# EAGLE board pressure_rigid_v2_no_flex (EAGLE 9.3.1), part 1 of 2
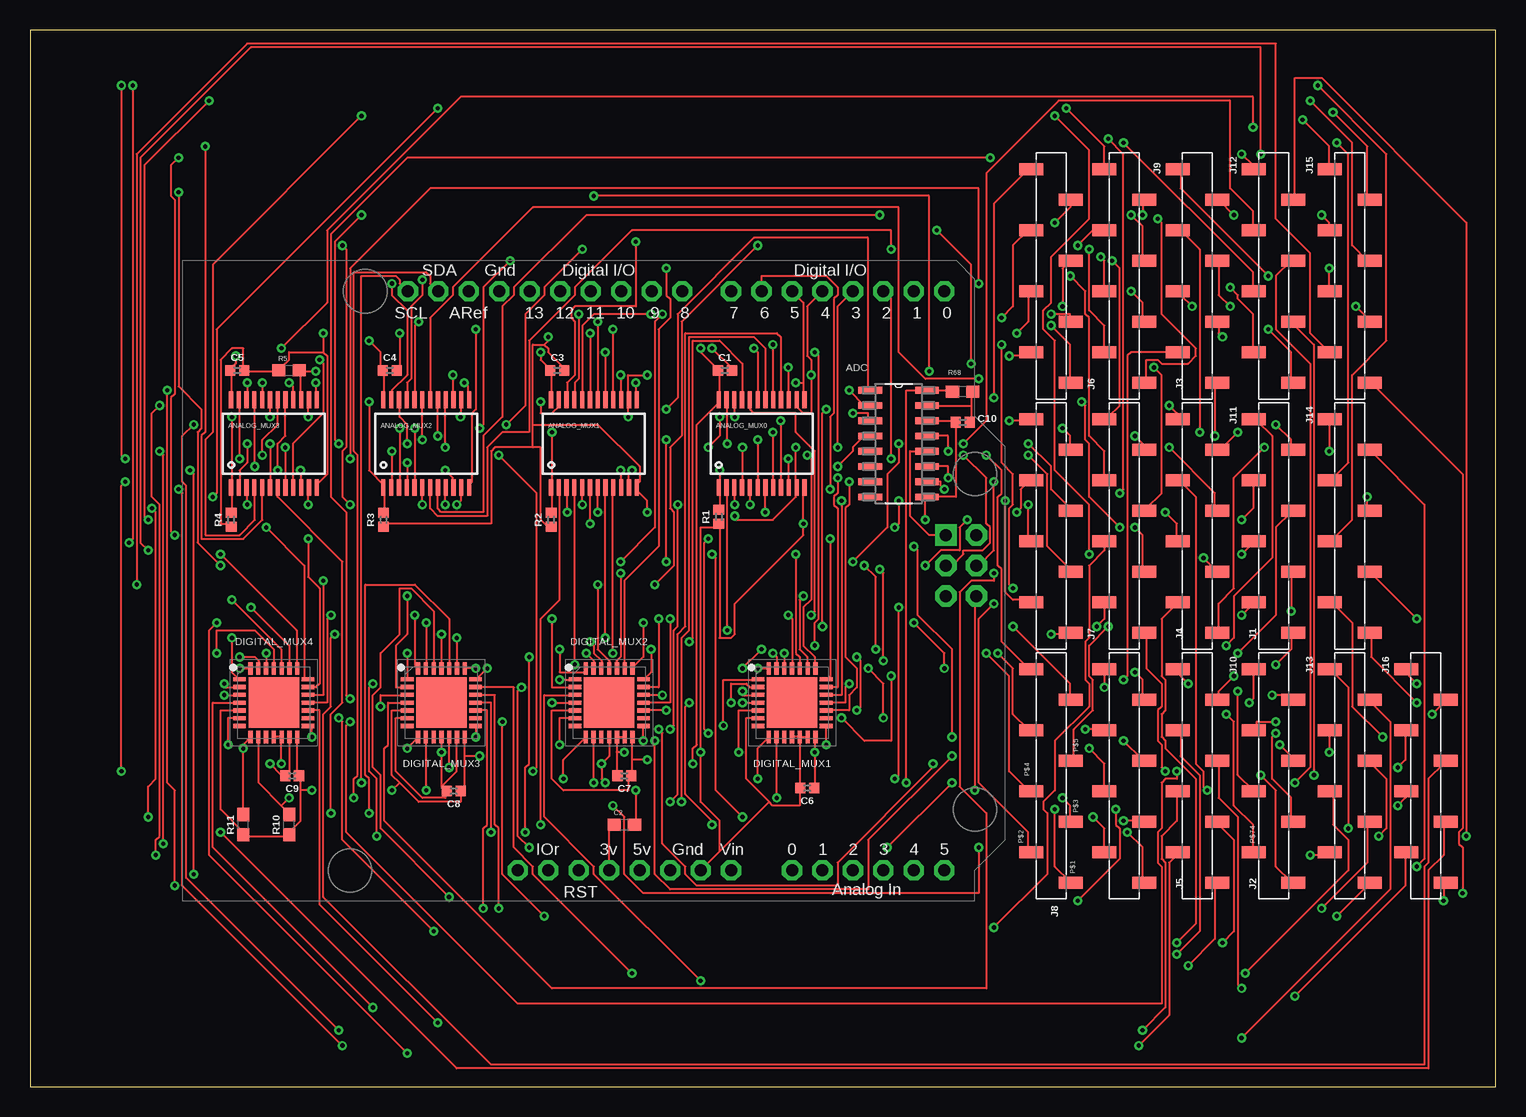
[diagram p1: board, top side]
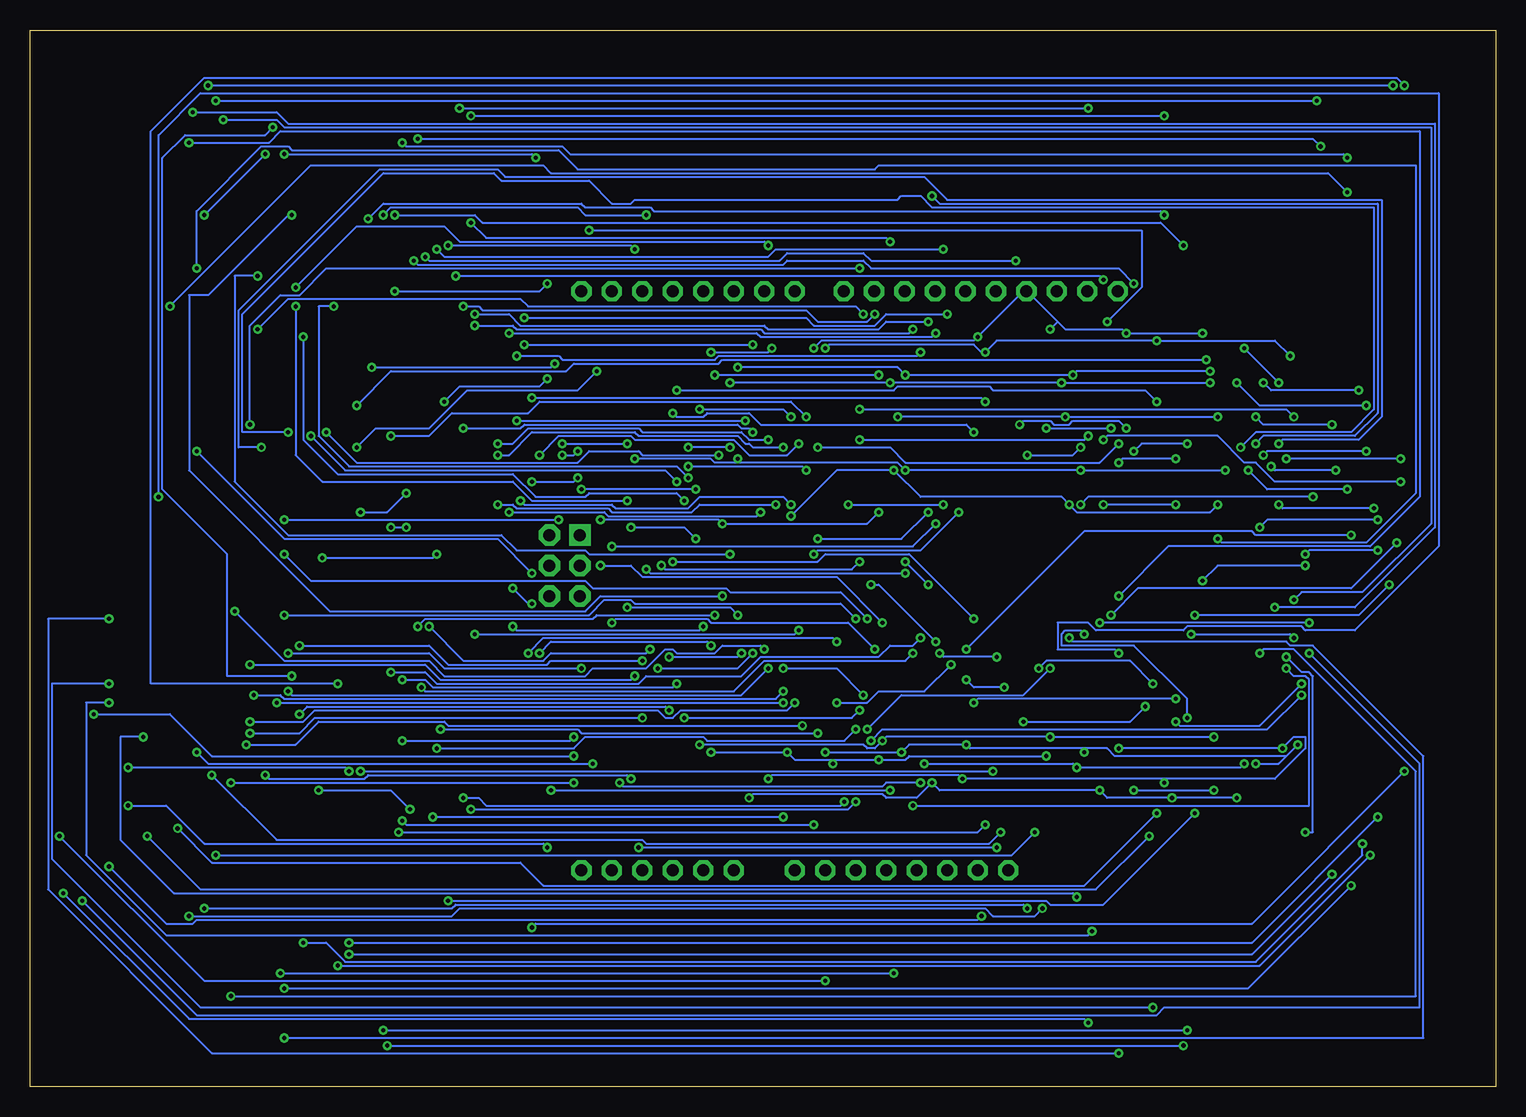
[diagram p2: board, bottom side, seen from below]

Size 122.15 x 88.06 mm. Coordinates in mm from the lower left corner, seen from the top.
Outline: 0,0 122.15,0 122.15,88.06 0,88.06 0,0
Copper layers (1*16): Top 0.035mm / dielectric 1.5mm / Bottom 0.035mm
Design rules "default": minimum track width 6mil, minimum drill 0.35mm, track to track 6mil, track to pad 6mil, pad to pad 6mil, via to via 6mil, smd to smd 6mil, copper to edge 40mil, drill to drill 6mil, minimum pad ring 10mil, minimum via ring 8mil, stop-mask expansion 4mil, vias tented up to drill 0mil, thermal gap 10mil
Net classes: 1 supply: width 0.076 mm, drill 0.076 mm, clearance 0.076 mm

## Footprints (pad centres in the part's own frame; a part is rotated, then mirrored left to right if it is on the bottom)
SOIC127P600X175-16N = smd 1.981 x 0.559: 1 -2.362,4.445; 2 -2.362,3.175; 3 -2.362,1.905; 4 -2.362,0.635; 5 -2.362,-0.635; 6 -2.362,-1.905; 7 -2.362,-3.175; 8 -2.362,-4.445; 9 2.362,-4.445; 10 2.362,-3.175; 11 2.362,-1.905; 12 2.362,-0.635; 13 2.362,0.635; 14 2.362,1.905; 15 2.362,3.175; 16 2.362,4.445
SSOP24 = smd 0.348 x 1.397: 1 -3.575,-3.656; 2 -2.925,-3.656; 3 -2.275,-3.656; 4 -1.625,-3.656; 5 -0.975,-3.656; 6 -0.325,-3.656; 7 0.325,-3.656; 8 0.975,-3.656; 9 1.625,-3.656; 10 2.275,-3.656; 11 2.925,-3.656; 12 3.575,-3.656; 13 3.575,3.656; 14 2.925,3.656; 15 2.275,3.656; 16 1.625,3.656; 17 0.975,3.656; 18 0.325,3.656; 19 -0.325,3.656; 20 -0.975,3.656; 21 -1.625,3.656; 22 -2.275,3.656; 23 -2.925,3.656; 24 -3.575,3.656
0402 = smd 0.85 x 0.9: 1 -0.58,0; 2 0.58,0
0603 = smd 1.1 x 1: 1 -0.85,0; 2 0.85,0
QFN65P600X600X100-29N = smd 1.05 x 0.35: 1 -2.85,1.95; 2 -2.85,1.3; 3 -2.85,0.65; 4 -2.85,0; 5 -2.85,-0.65; 6 -2.85,-1.3; 7 -2.85,-1.95; 15 2.85,-1.95; 16 2.85,-1.3; 17 2.85,-0.65; 18 2.85,0; 19 2.85,0.65; 20 2.85,1.3; 21 2.85,1.95 | smd 0.35 x 1.05: 8 -1.95,-2.85; 9 -1.3,-2.85; 10 -0.65,-2.85; 11 0,-2.85; 12 0.65,-2.85; 13 1.3,-2.85; 14 1.95,-2.85; 22 1.95,2.85; 23 1.3,2.85; 24 0.65,2.85; 25 0,2.85; 26 -0.65,2.85; 27 -1.3,2.85; 28 -1.95,2.85 | smd 4.2 x 4.2: 29 0,0
1X08_SMD = smd 1 x 2: 1 0,1.65; 2 -2.54,-1.65; 3 -5.08,1.65; 4 -7.62,-1.65; 5 -10.16,1.65; 6 -12.7,-1.65; 7 -15.24,1.65; 8 -17.78,-1.65
ARDUINOR3_ICSP_NODIM = drill 1 pad 1.676 octagon: 3V 35.56,2.54; 5V 38.1,2.54; A0 50.8,2.54; A1 53.34,2.54; A2 55.88,2.54; A3 58.42,2.54; A4 60.96,2.54; A5 63.5,2.54; AREF 23.876,50.8; D0 63.5,50.8; D1 60.96,50.8; D2 58.42,50.8; D3 55.88,50.8; D4 53.34,50.8; D5 50.8,50.8; D6 48.26,50.8; D7 45.72,50.8; D8 41.656,50.8; D9 39.116,50.8; D10 36.576,50.8; D11 34.036,50.8; D12 31.496,50.8; D13 28.956,50.8; GND 26.416,50.8; GND@1 43.18,2.54; GND@2 40.64,2.54; IOREF 30.48,2.54; RESERVED 27.94,2.54; RESET 33.02,2.54; SCL 18.796,50.8; SDA 21.336,50.8; VIN 45.72,2.54 | drill 1 pad 1.778 octagon: 5V_ICSP 66.167,30.48; GND@3 66.167,25.4; MOSI 66.167,27.94; RESET_ICSP 63.627,25.4; SCK 63.627,27.94 | drill 1 pad 1.778 square: MISO 63.627,30.48

## Placement (x,y rotation side)
ADC  MCP3008T-I/SL  [SOIC127P600X175-16N]  72.39,53.59 0 top
ANALOG_MUX0  MUX-74HC4067  [SSOP24]  60.96,53.59 0 top
ANALOG_MUX1  MUX-74HC4067  [SSOP24]  46.99,53.59 0 top
ANALOG_MUX2  MUX-74HC4067  [SSOP24]  33.02,53.59 0 top
ANALOG_MUX3  MUX-74HC4067  [SSOP24]  20.32,53.59 0 top
C1  0.1uF  [0402]  57.91,59.69 0 top
C2  0.1uF  [0603]  49.53,21.84 0 top
C3  0.1uF  [0402]  43.94,59.69 0 top
C4  0.1uF  [0402]  29.97,59.69 0 top
C5  0.1uF  [0402]  17.27,59.69 0 top
C6  0.1uF  [0402]  64.77,24.89 180 top
C7  0.1uF  [0402]  49.53,25.91 180 top
C8  0.1uF  [0402]  35.31,24.64 180 top
C9  0.1uF  [0402]  21.84,25.91 180 top
C10  0.1uF  [0402]  77.72,55.37 0 top
DIGITAL_MUX1  MCP23017T-E_ML  [QFN65P600X600X100-29N]  63.5,32 0 top
DIGITAL_MUX2  MCP23017T-E_ML  [QFN65P600X600X100-29N]  48.26,32 0 top
DIGITAL_MUX3  MCP23017T-E_ML  [QFN65P600X600X100-29N]  34.29,32 0 top
DIGITAL_MUX4  MCP23017T-E_ML  [QFN65P600X600X100-29N]  20.32,32 0 top
J1  [1X08_SMD]  97.28,37.85 270 top
J2  [1X08_SMD]  97.28,17.02 270 top
J3  [1X08_SMD]  91.19,58.67 270 top
J4  [1X08_SMD]  91.19,37.85 270 top
J5  [1X08_SMD]  91.19,17.02 270 top
J6  [1X08_SMD]  85.09,58.67 270 top
J7  [1X08_SMD]  85.09,37.85 270 top
J8  [1X08_SMD]  85.09,17.02 270 top
J9  [1X08_SMD]  97.28,76.45 90 top
J10  [1X08_SMD]  103.63,34.8 90 top
J11  [1X08_SMD]  103.63,55.63 90 top
J12  [1X08_SMD]  103.63,76.45 90 top
J13  [1X08_SMD]  109.98,34.8 90 top
J14  [1X08_SMD]  109.98,55.63 90 top
J15  [1X08_SMD]  109.98,76.45 90 top
J16  [1X08_SMD]  116.33,34.8 90 top
M1  ARDUINO_R3_ICSP_NODIM  [ARDUINOR3_ICSP_NODIM]  12.7,15.49 0 top
R1  2.2K  [0402]  57.4,47.5 90 top
R2  2.2K  [0402]  43.43,47.24 90 top
R3  2.2K  [0402]  29.46,47.24 90 top
R4  2.2K  [0402]  16.76,47.24 90 top
R5  0  [0603]  21.59,59.69 0 top
R10  4.7k  [0603]  21.59,21.84 90 top
R11  4.7k  [0603]  17.78,21.84 90 top
R68  100  [0603]  77.72,57.91 180 top